# EAGLE schematic module_template_misc (EAGLE 5.10)
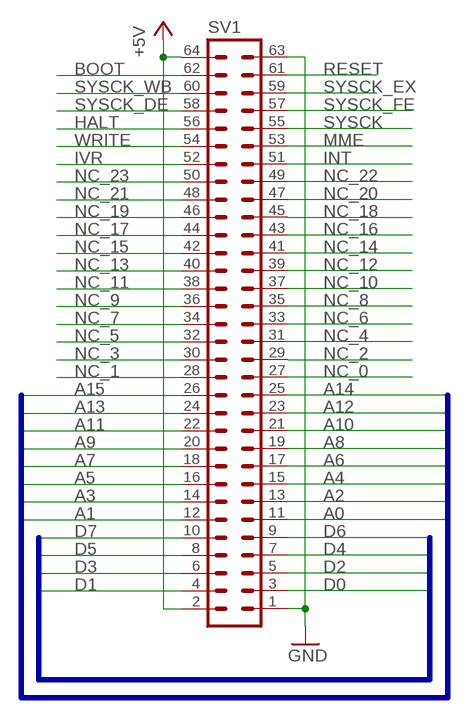
[diagram p0: schematic, sheet 1]

## Parts
SV1  ML64L  [ML64L]

## Nets
+5V: SV1.2 SV1.64
A0: SV1.11
A1: SV1.12
A2: SV1.13
A3: SV1.14
A4: SV1.15
A5: SV1.16
A6: SV1.17
A7: SV1.18
A8: SV1.19
A9: SV1.20
A10: SV1.21
A11: SV1.22
A12: SV1.23
A13: SV1.24
A14: SV1.25
A15: SV1.26
BOOT: SV1.62
D0: SV1.3
D1: SV1.4
D2: SV1.5
D3: SV1.6
D4: SV1.7
D5: SV1.8
D6: SV1.9
D7: SV1.10
GND: SV1.1 SV1.63
HALT: SV1.56
INT: SV1.51
IVR: SV1.52
MME: SV1.53
NC_0: SV1.27
NC_1: SV1.28
NC_2: SV1.29
NC_3: SV1.30
NC_4: SV1.31
NC_5: SV1.32
NC_6: SV1.33
NC_7: SV1.34
NC_8: SV1.35
NC_9: SV1.36
NC_10: SV1.37
NC_11: SV1.38
NC_12: SV1.39
NC_13: SV1.40
NC_14: SV1.41
NC_15: SV1.42
NC_16: SV1.43
NC_17: SV1.44
NC_18: SV1.45
NC_19: SV1.46
NC_20: SV1.47
NC_21: SV1.48
NC_22: SV1.49
NC_23: SV1.50
RESET: SV1.61
SYSCK: SV1.55
SYSCK_DE: SV1.58
SYSCK_EX: SV1.59
SYSCK_FE: SV1.57
SYSCK_WB: SV1.60
WRITE: SV1.54

## Buses
D[0..7]
A[0..15]

## Library data of the parts
SV1 = con-ml:ML64L: HARTING